# EAGLE design macrokeyboardV1.0 (EAGLE 9.6.2)
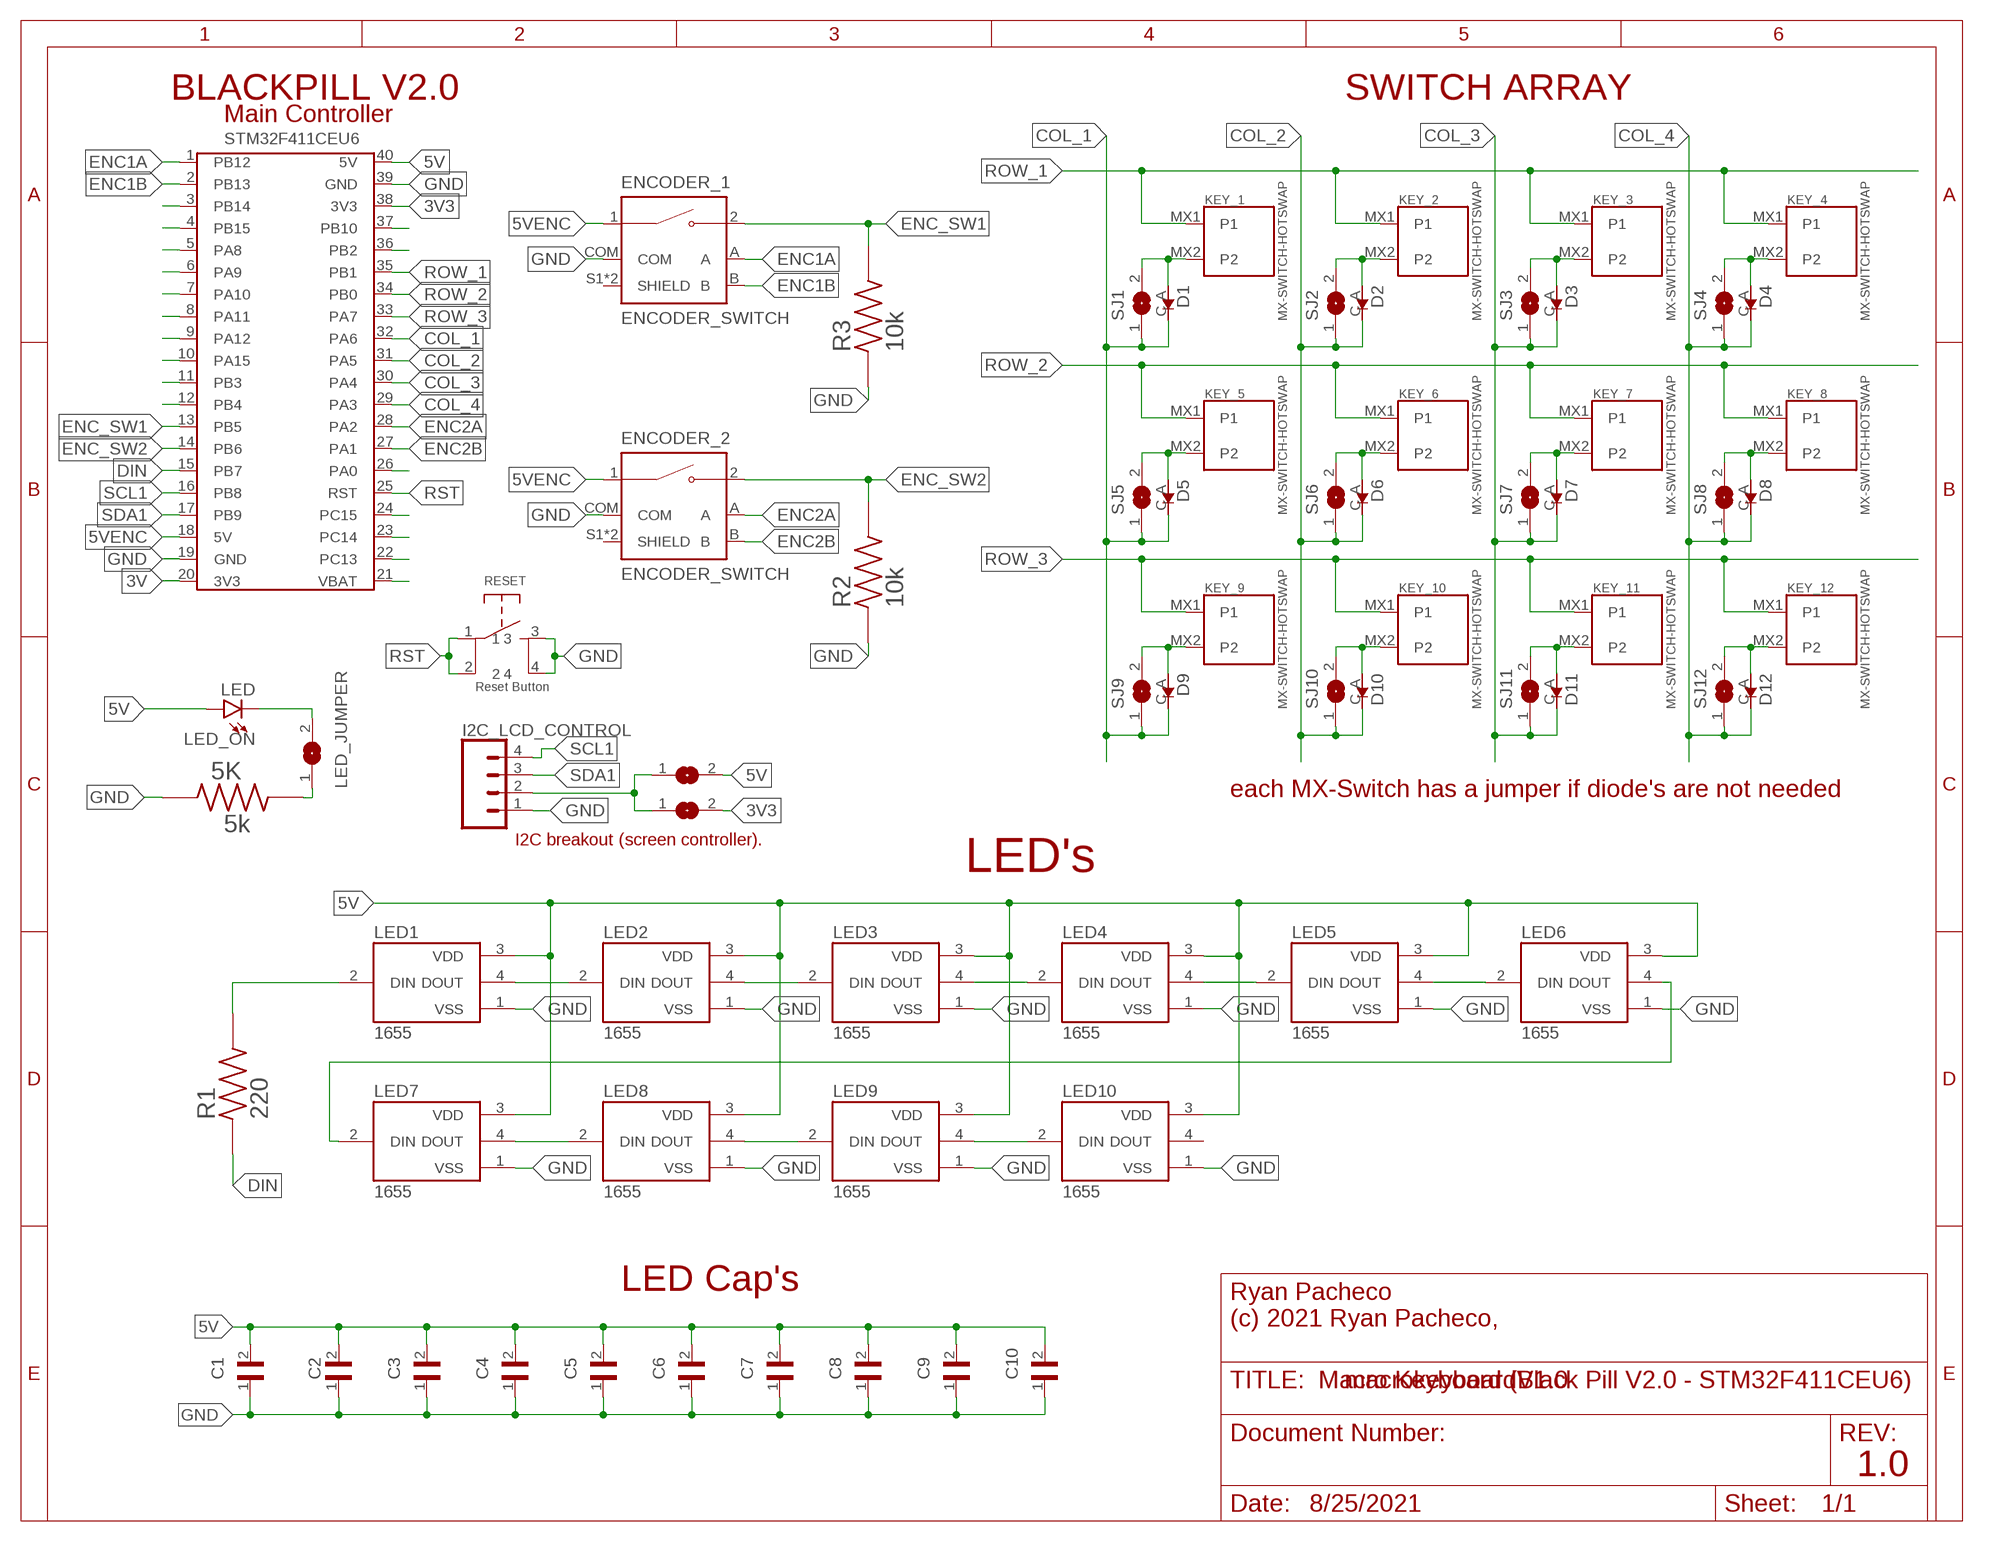
[diagram p0: schematic, sheet 1]

## Parts
3.3V_I2C  SJ  [SJ]
5K  5k  RMCF1206JT1K00  [RESC3216X70N]
5V_I2C  SJ  [SJ]
C1  100n  C1206C104K5RAC7210  [CAPC3216X88N]
C2  C1206C104K5RAC7210  [CAPC3216X88N]
C3  C1206C104K5RAC7210  [CAPC3216X88N]
C4  C1206C104K5RAC7210  [CAPC3216X88N]
C5  C1206C104K5RAC7210  [CAPC3216X88N]
C6  100nF  C1206C104K5RAC7210  [CAPC3216X88N]
C7  C1206C104K5RAC7210  [CAPC3216X88N]
C8  C1206C104K5RAC7210  [CAPC3216X88N]
C9  C1206C104K5RAC7210  [CAPC3216X88N]
C10  100nF  C1206C104K5RAC7210  [CAPC3216X88N]
D1  1N4148W-7-F  [SOD3715X135N]
D2  1N4148W-7-F  [SOD3715X135N]
D3  1N4148W-7-F  [SOD3715X135N]
D4  1N4148W-7-F  [SOD3715X135N]
D5  1N4148W-7-F  [SOD3715X135N]
D6  1N4148W-7-F  [SOD3715X135N]
D7  1N4148W-7-F  [SOD3715X135N]
D8  1N4148W-7-F  [SOD3715X135N]
D9  1N4148W-7-F  [SOD3715X135N]
D10  1N4148W-7-F  [SOD3715X135N]
D11  1N4148W-7-F  [SOD3715X135N]
D12  1N4148W-7-F  [SOD3715X135N]
ENCODER_1  ENCODER_SWITCH  PEC11R-4215F-S0024  [XDCR_PEC11R-4215F-S0024]
ENCODER_2  ENCODER_SWITCH  PEC11R-4215F-S0024  [XDCR_PEC11R-4215F-S0024]
I2C_LCD_CONTROL  CONN_04  [1X04]
KEY_1  MX-SWITCH-HOTSWAP  [MXHSPCB-1U]
KEY_2  MX-SWITCH-HOTSWAP  [MXHSPCB-1U]
KEY_3  MX-SWITCH-HOTSWAP  [MXHSPCB-1U]
KEY_4  MX-SWITCH-HOTSWAP  [MXHSPCB-1U]
KEY_5  MX-SWITCH-HOTSWAP  [MXHSPCB-1U]
KEY_6  MX-SWITCH-HOTSWAP  [MXHSPCB-1U]
KEY_7  MX-SWITCH-HOTSWAP  [MXHSPCB-1U]
KEY_8  MX-SWITCH-HOTSWAP  [MXHSPCB-1U]
KEY_9  MX-SWITCH-HOTSWAP  [MXHSPCB-1U]
KEY_10  MX-SWITCH-HOTSWAP  [MXHSPCB-1U]
KEY_11  MX-SWITCH-HOTSWAP  [MXHSPCB-1U]
KEY_12  MX-SWITCH-HOTSWAP  [MXHSPCB-1U]
LED1  1655  [LED_1655]
LED2  1655  [LED_1655]
LED3  1655  [LED_1655]
LED4  1655  [LED_1655]
LED5  1655  [LED_1655]
LED6  1655  [LED_1655]
LED7  1655  [LED_1655]
LED8  1655  [LED_1655]
LED9  1655  [LED_1655]
LED10  1655  [LED_1655]
LED_JUMPER  SJ  [SJ]
LED_ON  LED  LED1206  [LED-1206]
R1  220  RMCF1206JT1K00  [RESC3216X70N]
R2  10k  RMCF1206JT1K00  [RESC3216X70N]
R3  10k  RMCF1206JT1K00  [RESC3216X70N]
RESET  Reset Button  PUSHBUTTON(THROUGH_HOLE)  [PUSHBUTTON]
SJ1  SJ  [SJ]
SJ2  SJ  [SJ]
SJ3  SJ  [SJ]
SJ4  SJ  [SJ]
SJ5  SJ  [SJ]
SJ6  SJ  [SJ]
SJ7  SJ  [SJ]
SJ8  SJ  [SJ]
SJ9  SJ  [SJ]
SJ10  SJ  [SJ]
SJ11  SJ  [SJ]
SJ12  SJ  [SJ]
U$2  STM32F411CEU6  [BLACKPILL_V2]

## Nets
3V: U$2.20(3V3)
3V3: 3.3V_I2C.2 U$2.38(3V3)
5V: 5V_I2C.2 C1.2 C2.2 C3.2 C4.2 C5.2 C6.2 C7.2 C8.2 C9.2 C10.2 LED1.3(VDD) LED2.3(VDD) LED3.3(VDD) LED4.3(VDD) LED5.3(VDD) LED6.3(VDD) LED7.3(VDD) LED8.3(VDD) LED9.3(VDD) LED10.3(VDD) LED_ON.A U$2.40(5V)
5VENC: ENCODER_1.1 ENCODER_2.1 U$2.18(5V)
COL_1: D1.C(K) D5.C(K) D9.C(K) SJ1.1 SJ5.1 SJ9.1 U$2.32(PA6)
COL_2: D2.C(K) D6.C(K) D10.C(K) SJ2.1 SJ6.1 SJ10.1 U$2.31(PA5)
COL_3: D3.C(K) D7.C(K) D11.C(K) SJ3.1 SJ7.1 SJ11.1 U$2.30(PA4)
COL_4: D4.C(K) D8.C(K) D12.C(K) SJ4.1 SJ8.1 SJ12.1 U$2.29(PA3)
DIN: R1.1 U$2.15(PB7)
ENC1A: ENCODER_1.A U$2.1(PB12)
ENC1B: ENCODER_1.B U$2.2(PB13)
ENC2A: ENCODER_2.A U$2.28(PA2)
ENC2B: ENCODER_2.B U$2.27(PA1)
ENC_SW1: ENCODER_1.2 R3.2 U$2.13(PB5)
ENC_SW2: ENCODER_2.2 R2.2 U$2.14(PB6)
GND: 5K.2 C1.1 C2.1 C3.1 C4.1 C5.1 C6.1 C7.1 C8.1 C9.1 C10.1 ENCODER_1.COM ENCODER_2.COM I2C_LCD_CONTROL.1 LED1.1(VSS) LED2.1(VSS) LED3.1(VSS) LED4.1(VSS) LED5.1(VSS) LED6.1(VSS) LED7.1(VSS) LED8.1(VSS) LED9.1(VSS) LED10.1(VSS) R2.1 R3.1 RESET.3 RESET.4 U$2.19(GND) U$2.39(GND)
N$1: D1.A KEY_1.MX2(P2) SJ1.2
N$2: D2.A KEY_2.MX2(P2) SJ2.2
N$3: D3.A KEY_3.MX2(P2) SJ3.2
N$4: D4.A KEY_4.MX2(P2) SJ4.2
N$5: D5.A KEY_5.MX2(P2) SJ5.2
N$6: D6.A KEY_6.MX2(P2) SJ6.2
N$7: D7.A KEY_7.MX2(P2) SJ7.2
N$8: D8.A KEY_8.MX2(P2) SJ8.2
N$9: D9.A KEY_9.MX2(P2) SJ9.2
N$10: D10.A KEY_10.MX2(P2) SJ10.2
N$11: D11.A KEY_11.MX2(P2) SJ11.2
N$12: D12.A KEY_12.MX2(P2) SJ12.2
N$15: U$2.3(PB14)
N$16: U$2.4(PB15)
N$17: U$2.5(PA8)
N$18: U$2.6(PA9)
N$19: U$2.7(PA10)
N$20: U$2.8(PA11)
N$21: U$2.9(PA12)
N$22: U$2.10(PA15)
N$23: U$2.11(PB3)
N$24: U$2.12(PB4)
N$25: 5K.1 LED_JUMPER.1
N$27: LED_JUMPER.2 LED_ON.C
N$28: LED1.2(DIN) R1.2
N$29: LED1.4(DOUT) LED2.2(DIN)
N$30: LED2.4(DOUT) LED3.2(DIN)
N$31: LED7.4(DOUT) LED8.2(DIN)
N$32: LED8.4(DOUT) LED9.2(DIN)
N$33: U$2.23(PC14)
N$34: U$2.24(PC15)
N$35: 3.3V_I2C.1 5V_I2C.1 I2C_LCD_CONTROL.2
N$36: U$2.26(PA0)
N$37: LED6.4(DOUT) LED7.2(DIN)
N$39: LED9.4(DOUT) LED10.2(DIN)
N$42: LED5.4(DOUT) LED6.2(DIN)
N$43: U$2.21(VBAT)
N$44: LED4.4(DOUT) LED5.2(DIN)
N$45: LED3.4(DOUT) LED4.2(DIN)
N$47: U$2.36(PB2)
N$48: U$2.22(PC13)
N$49: U$2.37(PB10)
ROW_1: KEY_1.MX1(P1) KEY_2.MX1(P1) KEY_3.MX1(P1) KEY_4.MX1(P1) U$2.35(PB1)
ROW_2: KEY_5.MX1(P1) KEY_6.MX1(P1) KEY_7.MX1(P1) KEY_8.MX1(P1) U$2.34(PB0)
ROW_3: KEY_9.MX1(P1) KEY_10.MX1(P1) KEY_11.MX1(P1) KEY_12.MX1(P1) U$2.33(PA7)
RST: RESET.1 RESET.2 U$2.25(RST)
SCL1: I2C_LCD_CONTROL.4 U$2.16(PB8)
SDA1: I2C_LCD_CONTROL.3 U$2.17(PB9)
Unconnected: ENCODER_1.S1(SHIELD) ENCODER_1.S2(SHIELD) ENCODER_2.S1(SHIELD) ENCODER_2.S2(SHIELD) LED10.4(DOUT)

## Notes on the sheet
- BLACKPILL V2.0 | SWITCH ARRAY
- Main Controller
- each MX-Switch has a jumper if diode's are not needed
- I2C breakout (screen controller).
- LED's
- LED Cap's
- Ryan Pacheco
  (c) 2021 Ryan Pacheco,
- Macro Keyboard (Black Pill V2.0 - STM32F411CEU6)
- 1.0
- 8/25/2021

## Library data of the parts
3.3V_I2C 5V_I2C LED_JUMPER SJ1-SJ12 = jumper:SJ: SMD solder JUMPER
5K R1-R3 = RMCF1206JT1K00:RMCF1206JT1K00; DESCRIPTION: 1 kOhms ±5% 0.25W, 1/4W Chip Resistor 1206 (3216 Metric) Automotive AEC-Q200 Thick Film; DIGI-KEY_PART_NUMBER: RMCF1206JT1K00CT-ND; MF: Stackpole Electronics Inc; MP: RMCF1206JT1K00; PACKAGE: 3216 Stackpole
C1-C10 = C1206C104K5RAC7210:C1206C104K5RAC7210: Cap Ceramic 0.1uF 50V X7R 10% Pad SMD 1206 125°C T/R; DESCRIPTION: 0.1µF ±10% 50V Ceramic Capacitor X7R 1206 (3216 Metric); DIGI-KEY_PART_NUMBER: 399-7357-2-ND; MF: KEMET; MP: C1206C104K5RAC7210; PACKAGE: 3216 KEMET; PURCHASE-URL: https://pricing.snapeda.com/search/part/C1206C104K5RAC7210/?ref=eda
D1-D12 = 1N4148W-7-F:1N4148W-7-F: 1N4148W Series 2 A 100 V 400 mW Surface Mount Fast Switching Diode - SOD-123; DESCRIPTION: Diode Standard 100V 300mA (DC) Surface Mount SOD-123; DIGI-KEY_PART_NUMBER: 1N4148W-FDICT-ND; MF: Diodes Inc.; MP: 1N4148W-7-F; PACKAGE: SOD-123 Fairchild Semiconductor; PURCHASE-URL: https://pricing.snapeda.com/search/part/1N4148W-7-F/?ref=eda
ENCODER_1 ENCODER_2 = PEC11R-4215F-S0024:PEC11R-4215F-S0024: Incremental Encoder, 12 Mm, Contact Rating 10 Ma - 5 Vdc Check prices <https://pricing.snapeda.com/parts/PEC11R-4215F-S0024/Bourns/view-part?ref=eda>; AVAILABILITY: In Stock; DESCRIPTION: Rotary Encoder Mechanical 24 Quadrature (Incremental) Vertical; MF: Bourns; MP: PEC11R-4215F-S0024; PACKAGE: None; PRICE: None; PURCHASE-URL: https://pricing.snapeda.com/search/part/PEC11R-4215F-S0024/?ref=eda
I2C_LCD_CONTROL = SparkFun-Connectors:CONN_04: Multi connection point. Often used as Generic Header-pin footprint for 0.1 inch spaced/style header connections On any of the 0.1 inch spaced packages, you can populate with these: Break Away Headers - Straight <https://www.sparkfun.com/products/116> (PRT-00116) Break Away Male Headers - Right Angle <https://www.sparkfun.com/products/553> (PRT-00553) Female Headers <https://www.sparkfun.com/products/115> (PRT-00115) Break Away Headers - Machine Pin <https://www.sparkfun.com/products/117> (PRT-00117) Break Away Female Headers - Swiss Machine Pin <https://www.sparkfun.com/products/743> (PRT-00743) For SCREWTERMINALS and SPRING TERMINALS visit here: Screw Terimnals on SparkFun.com <https://www.sparkfun.com/search/results?term=Screw+Terminals> (5mm/3.5mm/2.54mm spacing) This device is also useful as a general connection point to wire up your design to another part of your project. Our various solder wires solder well into these plated through hole pads. Hook-Up Wire - Assortment (Stranded, 22 AWG) <https://www.sparkfun.com/products/11375> (PRT-11375) Hook-Up Wire - Assortment (Solid Core, 22 AWG) <https://www.sparkfun.com/products/11367> (PRT-11367) View the entire wire category on our website here <https://www.sparkfun.com/categories/141> Special notes: Molex polarized connector foot print use with SKU : PRT-08231 with associated crimp pins and housings. 1MM SMD Version SKU: PRT-10208; PROD_ID: CONN-09696
KEY_1-KEY_12 = Keyboard:MX-SWITCH-HOTSWAP: FOR KAILH HOTSWAPS WITH MX_SWITCHES
LED1-LED10 = 1655:1655: Ws2812b 5050 Rgb Led With Integrated Driver Chip Pack Of 10; DESCRIPTION: Addressable Lighting Neopixel 10 LED Discrete Serial (Shift Register) Red, Green, Blue (RGB) 5.00mm L x 5.00mm W; MF: Adafruit; MP: 1655; PACKAGE: TO-3 Adafruit; PURCHASE-URL: https://pricing.snapeda.com/search/part/1655/?ref=eda
LED_ON = SparkFun-LED:LED: LED (Generic) Standard schematic elements and footprints for 5mm, 3mm, 1206, and 0603 sized LEDs. Generic LEDs with no color specified.
RESET = pushbutton (through hole):PUSHBUTTON(THROUGH_HOLE)
U$2 = BlackPill_STM32F411CEU6:STM32F411CEU6

## Board
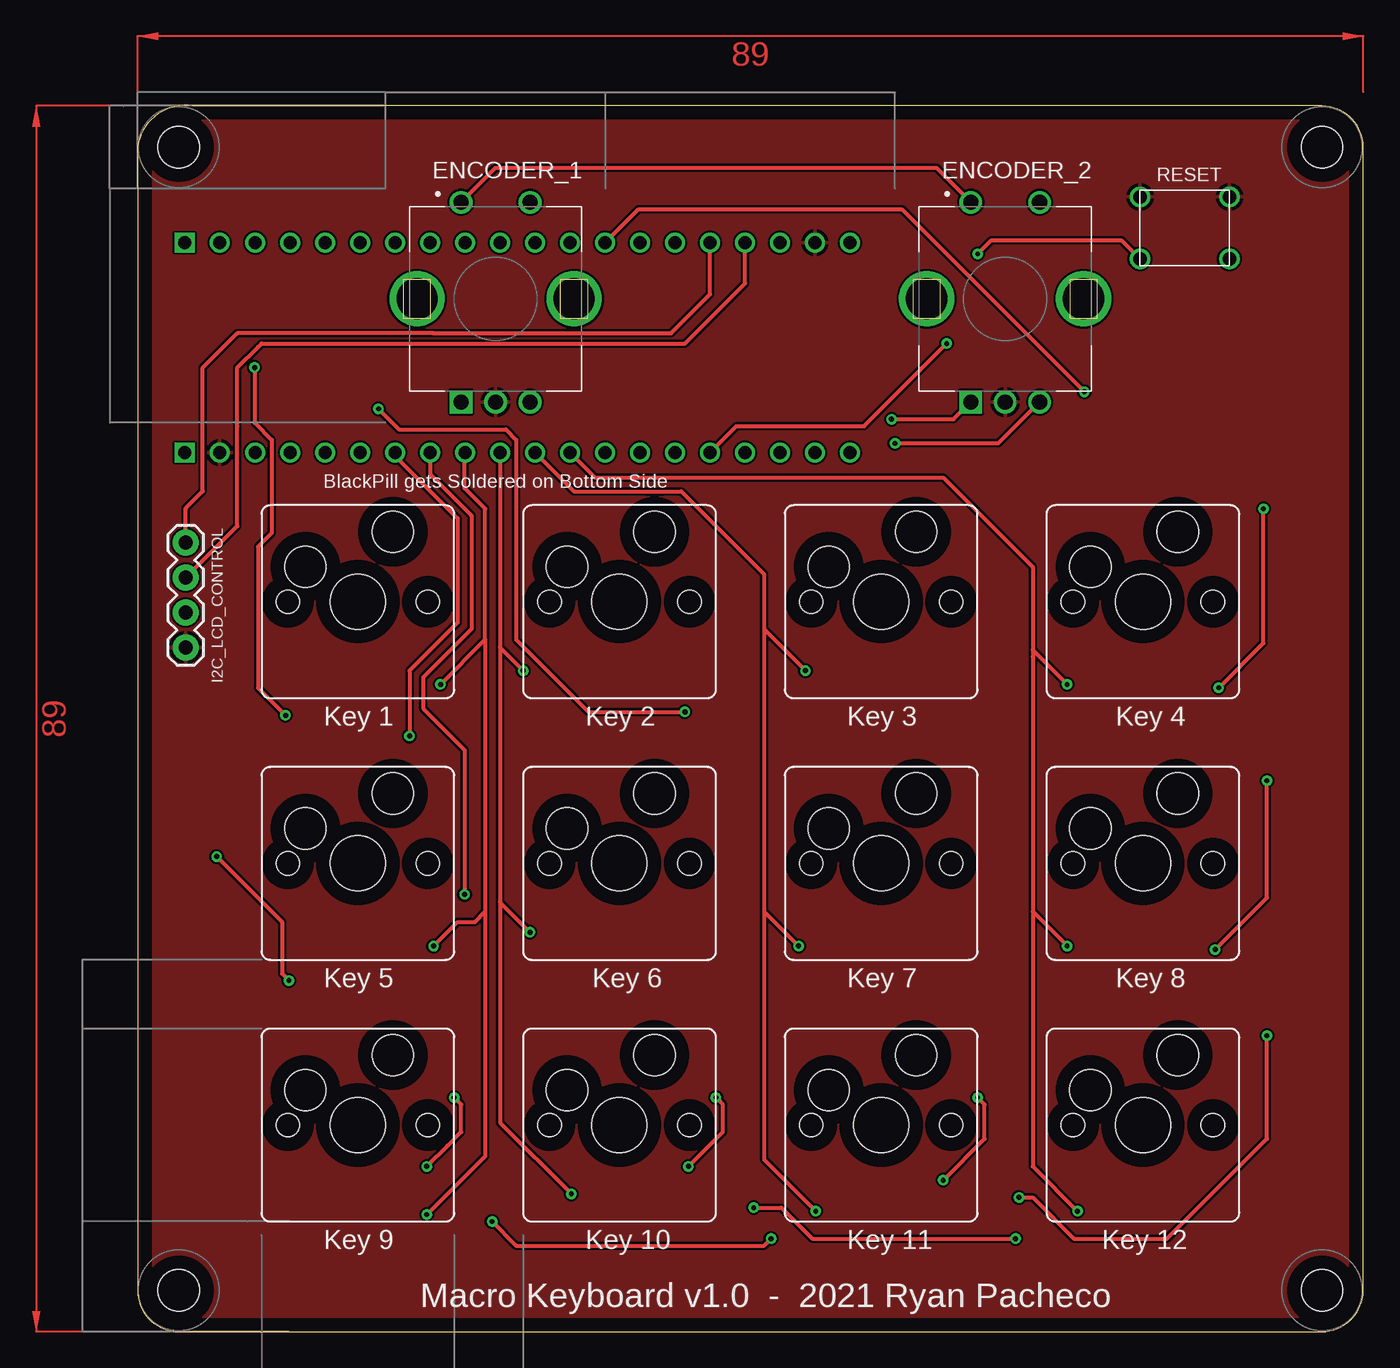
[diagram p1: board, top side]
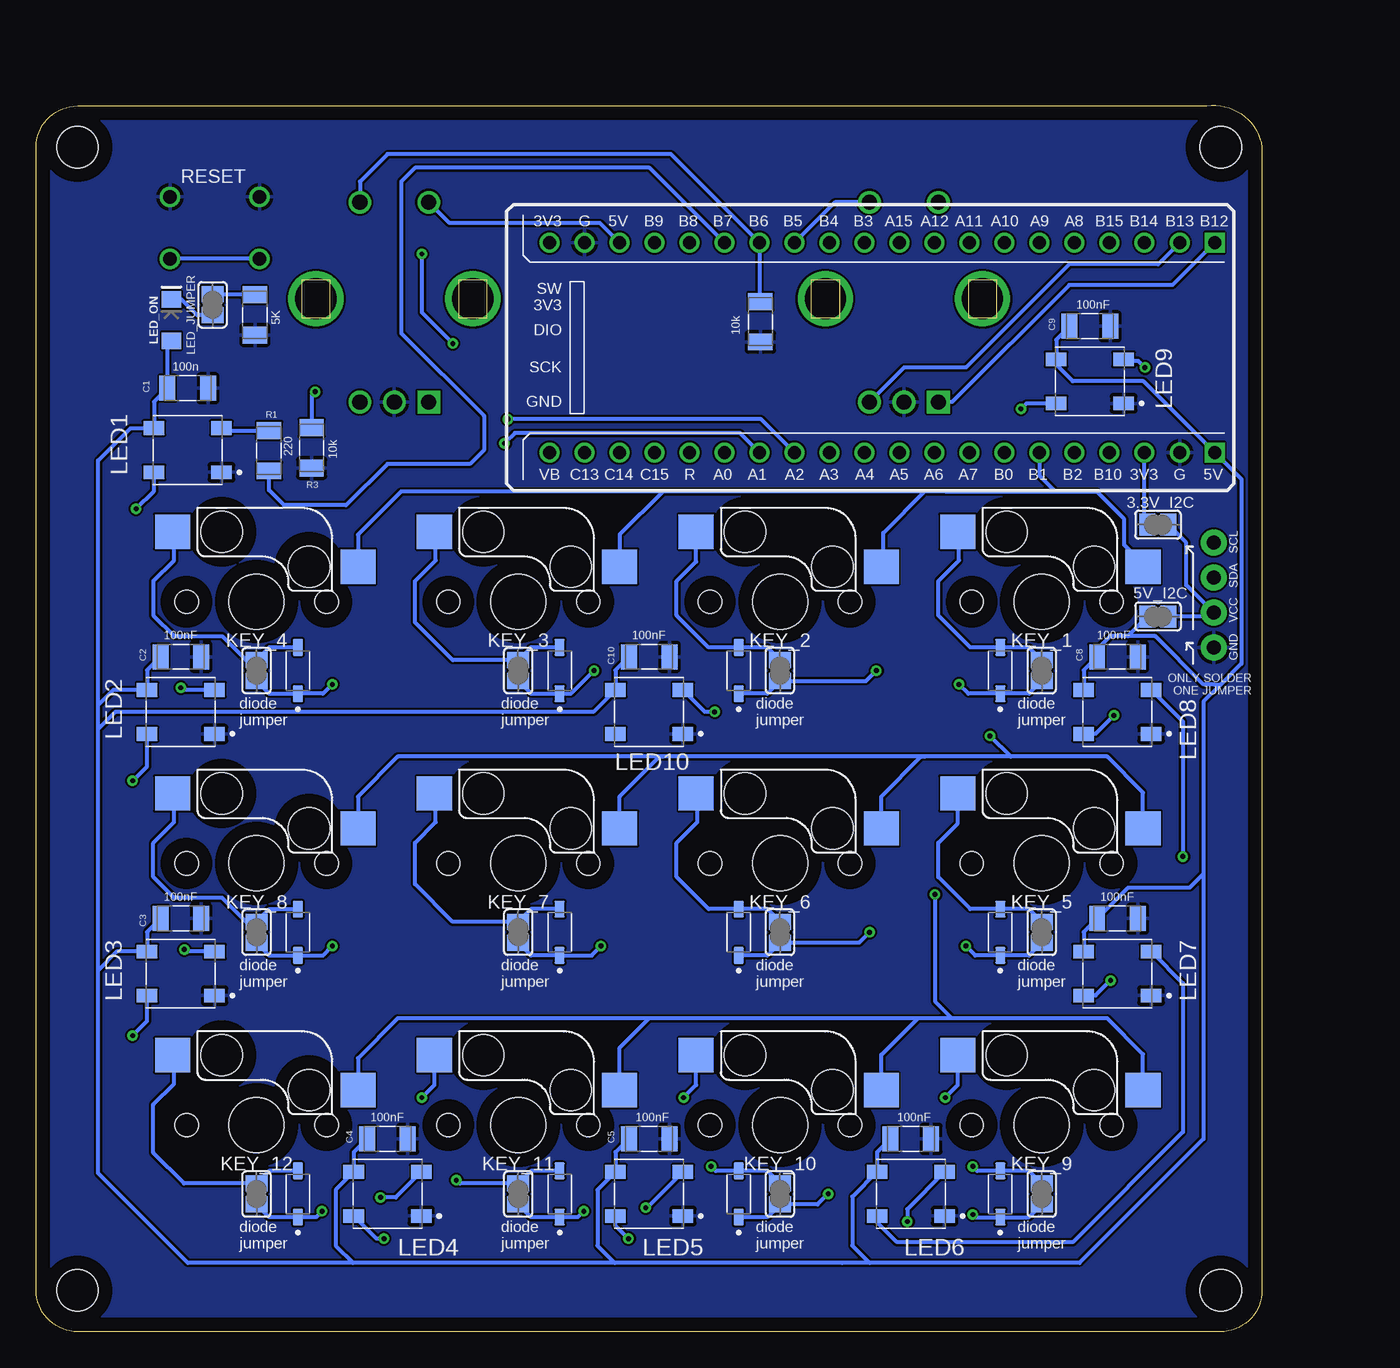
[diagram p2: board, bottom side, seen from below]

Size 89 x 89.03 mm. Coordinates in mm from the lower left corner, seen from the top.
Outline: 0,86 0,3 arc90 3,0 86,0 arc90 89,3 89,86 arc90 86,89 4,89 arc90 0,86
Copper layers (1*16): Top 0.035mm / dielectric 1.5mm / Bottom 0.035mm
Design rules "default": minimum track width 6mil, minimum drill 0.35mm, track to track 6mil, track to pad 6mil, pad to pad 6mil, via to via 6mil, smd to smd 6mil, copper to edge 40mil, drill to drill 6mil, minimum pad ring 10mil, minimum via ring 8mil, stop-mask expansion 4mil, vias tented up to drill 0mil, thermal gap 10mil
Holes 3 mm at 3,86 86,86 3,3 86,3

### Footprints (pad centres in the part's own frame; a part is rotated, then mirrored left to right if it is on the bottom)
SJ = smd 1.168 x 1.6: 1 -0.762,0; 2 0.762,0
RESC3216X70N = smd 1.23 x 1.77: 1 -1.466,0; 2 1.466,0
CAPC3216X88N = smd 1.16 x 1.82: 1 -1.475,0; 2 1.475,0
SOD3715X135N = smd 1.21 x 0.73: A 1.68,0; C -1.68,0
XDCR_PEC11R-4215F-S0024 = drill 1.1: 1 -2.5,7; 2 2.5,7; B 2.5,-7.5; COM 0,-7.5 | drill 1.1 square: A -2.5,-7.5 | drill 3: S1 -5.7,0; S2 5.7,0
1X04 = drill 1.016 pad 1.88: 1 0,0; 2 2.54,0; 3 5.08,0; 4 7.62,0
MXHSPCB-1U = smd 2.55 x 2.5: MX1 7.36,2.54; MX2 -6.09,5.08 | hole 4: 0,0 | hole 1.7: 5.08,0; -5.08,0 | hole 3: 3.81,2.54; -2.54,5.08
LED_1655 = smd 1.5 x 1: 1 -2.45,1.6; 2 -2.45,-1.6; 3 2.45,-1.6; 4 2.45,1.6
LED-1206 = smd 1.2 x 1.4: A -1.5,0; C 1.5,0
PUSHBUTTON = drill 1: 1 -3.5,2.5; 2 3,2.5; 3 -3.5,-2; 4 3,-2
BLACKPILL_V2 = drill 0.92 square: 1 -25.005,-7.62; 40 -25.005,7.62 | drill 0.92: 2 -22.465,-7.62; 3 -19.89,-7.62; 4 -17.35,-7.62; 5 -14.81,-7.62; 6 -12.27,-7.62; 7 -9.73,-7.62; 8 -7.19,-7.62; 9 -4.65,-7.62; 10 -2.11,-7.62; 11 0.43,-7.62; 12 2.97,-7.62; 13 5.51,-7.62; 14 8.05,-7.62; 15 10.59,-7.62; 16 13.13,-7.62; 17 15.67,-7.62; 18 18.21,-7.62; 19 20.75,-7.62; 20 23.29,-7.62; 21 23.29,7.62; 22 20.75,7.62; 23 18.21,7.62; 24 15.67,7.62; 25 13.13,7.62; 26 10.59,7.62; 27 8.05,7.62; 28 5.51,7.62; 29 2.97,7.62; 30 0.43,7.62; 31 -2.11,7.62; 32 -4.65,7.62; 33 -7.19,7.62; 34 -9.73,7.62; 35 -12.27,7.62; 36 -14.81,7.62; 37 -17.35,7.62; 38 -19.89,7.62; 39 -22.465,7.62

### Placement (x,y rotation side)
3.3V_I2C  7.56,58.59 180 bottom
5K  73.12,73.83 270 bottom
5V_I2C  7.56,51.92 180 bottom
C1  78,68.5 180 bottom
C2  78.5,49 180 bottom
C3  78.5,30 180 bottom
C4  63.5,14 180 bottom
C5  44.5,14 180 bottom
C6  25.5,14 180 bottom
C7  10.5,30 180 bottom
C8  10.5,49 180 bottom
C9  12.5,73 180 bottom
C10  44.5,49 180 bottom
D1  19,48 90 bottom
D2  38,48 90 bottom
D3  51,48 90 bottom
D4  70,48 90 bottom
D5  19,29 90 bottom
D6  38,29 90 bottom
D7  51,29 90 bottom
D8  70,29 90 bottom
D9  19,10 90 bottom
D10  38,10 90 bottom
D11  51,10 90 bottom
D12  70,10 90 bottom
ENCODER_1  26,75 0 top
ENCODER_2  63,75 0 top
I2C_LCD_CONTROL  3.51,49.67 90 top
KEY_1  16,53 0 bottom
KEY_2  35,53 0 bottom
KEY_3  54,53 0 bottom
KEY_4  73,53 0 bottom
KEY_5  16,34 0 bottom
KEY_6  35,34 0 bottom
KEY_7  54,34 0 bottom
KEY_8  73,34 0 bottom
KEY_9  16,15 0 bottom
KEY_10  35,15 0 bottom
KEY_11  54,15 0 bottom
KEY_12  73,15 0 bottom
LED1  78,64 180 bottom
LED2  78.5,45 180 bottom
LED3  78.5,26 180 bottom
LED4  63.5,10 180 bottom
LED5  44.5,10 180 bottom
LED6  25.5,10 180 bottom
LED7  10.5,26 180 bottom
LED8  10.5,45 180 bottom
LED9  12.5,69 180 bottom
LED10  44.5,45 180 bottom
LED_JUMPER  76.2,74.56 270 bottom
LED_ON  79.19,73.44 90 bottom
R1  72.1,63.97 90 bottom
R2  36.42,73.33 90 bottom
R3  69,64.17 90 bottom
RESET  75.79,80.39 180 top
SJ1  16,48 90 bottom
SJ2  35,48 90 bottom
SJ3  54,48 90 bottom
SJ4  73,48 90 bottom
SJ5  16,29 90 bottom
SJ6  35,29 90 bottom
SJ7  54,29 90 bottom
SJ8  73,29 90 bottom
SJ9  16,10 90 bottom
SJ10  35,10 90 bottom
SJ11  54,10 90 bottom
SJ12  73,10 90 bottom
U$2  28.44,71.45 180 bottom

### Tracks (layer width: path | path; a pad name or v marks a point on that pad's centre or on a via)
3V3
  Bottom 0.305: 3.3V_I2C.2 8.55,58.82 U$2.38
5V
  Bottom 0.305: C1.2 79.49,68.49 | 79.49,68.49 80.45,67.53 LED1.3 82.15,65.6 84.5,63.25 84.5,45.5 | C6.2 27.95,13.03 LED6.3 29.75,9.8 29.75,6.25 28.5,5 | C5.2 46.95,13.03 LED5.3 48.25,10.3 48.25,6.25 47,5 | C4.2 65.95,13.03 LED4.3 67.25,10.3 67.25,6.25 66,5 | LED7.3 12.95,29.02 C7.2 9.72,32.25 5.25,32.25 4.25,33.25 | C8.2 11.99,48.99 | 11.99,48.99 12.95,48.02 LED8.3 | 5V_I2C.2 9.74,50.5 | 11.99,48.99 11.99,49.51 11,50.5 9.99,50.5 9.74,50.5 | C10.2 46.95,48.02 LED10.3 48.55,45 83.25,45 84.5,43.75 | C3.2 80.95,29.02 LED3.3 83.15,27.6 84.5,26.25 | C2.2 80.95,48.02 LED2.3 83.4,46.6 84.5,45.5 | C9.2 14.95,72.03 LED9.3 14.95,70.2 13.75,69 8.61,69 U$2.40 1.5,61.9 1.5,48.5 3,47 | 9.74,50.5 7.75,50.5 4.25,47 3.5,47 3,47 | 3,47 4.25,45.75 4.25,33.25 | 4.25,33.25 4.25,14 13.25,5 28.5,5 | 84.5,26.25 84.5,11.5 78,5 66,5 | 84.5,26.25 84.5,43.75 | 84.5,43.75 84.5,45.5 | 28.5,5 30.5,5 47,5 | 47,5 66,5 | LED_ON.A 79.49,71.64 79.49,68.49
5VENC
  Top 0.305: ENCODER_1.1 26,84.5 58,84.5 ENCODER_2.1
  Bottom 0.305: U$2.18 48.08,80.5 59,80.5 ENCODER_2.1
COL_1  (via drill 0.35)
  Top 0.305: v21,8.5 25.25,12.75 25.25,30.5 | 25.25,50.25 25.25,59.75 23.75,61.25 23.75,63.79 U$2.32 | 25.25,50.25 25.25,31.75 25.25,30.5 | v22,47 25.25,50.25 | v21.5,28 23.25,29.75 24.5,29.75 25.25,30.5
  Bottom 0.305: SJ9.1 16.92,8.32 D9.C 20.82,8.32 v21,8.5 | SJ5.1 16.92,27.32 D5.C 20.82,27.32 v21.5,28 | SJ1.1 16.92,46.32 D1.C 21.32,46.32 v22,47
COL_2  (via drill 0.35)
  Top 0.305: 26.33,49.75 26.33,31.25 | 26.33,31.25 26.33,15.17 v31.5,10 | v28.5,29 26.33,31.17 26.33,31.25 | v28,48 26.33,49.67 26.33,49.75 | U$2.31 26.33,49.75
  Bottom 0.305: D10.C 35.92,8.32 SJ10.1 32.26,9.24 v31.5,10 | D6.C 35.92,27.32 SJ6.1 29.26,28.24 v28.5,29 | D2.C 35.92,46.32 SJ2.1 28.76,47.24 v28,48
COL_3  (via drill 0.35)
  Top 0.305: v49.25,8.75 45.5,12.5 45.5,30.5 | 45.5,51 45.5,55 39.5,61 31.7,61 U$2.30 | 45.5,51 45.5,30.5 | v48,28 45.5,30.5 | v48.5,48 45.5,51
  Bottom 0.305: SJ11.1 53.08,8.32 D11.C 49.68,8.32 v49.25,8.75 | SJ7.1 53.08,27.32 D7.C 48.68,27.32 v48,28 | SJ3.1 53.08,46.32 D3.C 50.18,46.32 v48.5,48
COL_4  (via drill 0.35)
  Top 0.305: v68.25,8.75 65,12 65,30.5 | 65,49.5 65,55.5 58.5,62 33.24,62 U$2.29 | 65,49.5 65,49 65,30.5 | v67.5,28 65,30.5 | 65,49.5 v67.5,47
  Bottom 0.305: SJ12.1 72.08,8.32 D12.C 68.68,8.32 v68.25,8.75 | SJ8.1 72.08,27.32 D8.C 68.18,27.32 v67.5,28 | SJ4.1 72.08,46.32 D4.C 68.18,46.32 v67.5,47
DIN
  Bottom 0.305: R1.1 72.1,61.1 71,60 66.5,60 63.5,63 57.5,63 56.5,64 56.5,66.5 62.5,72.5 62.5,83.5 61.5,84.5 44.46,84.5 U$2.15
ENC1A
  Bottom 0.305: U$2.1 6.5,76 14,76 22.5,67.5 ENCODER_1.A
ENC1B
  Bottom 0.305: U$2.2 7.54,77.5 14,77.5 21.5,70 26,70 ENCODER_1.B
ENC2A  (via drill 0.35)
  Top 0.305: v54.75,66.25 59.25,66.25 ENCODER_2.A
  Bottom 0.305: U$2.28 36.37,66.25 v54.75,66.25
ENC2B  (via drill 0.35)
  Top 0.305: v55,64.5 62.5,64.5 ENCODER_2.B
  Bottom 0.305: U$2.27 37.91,65.25 38.5,65.25 54.25,65.25 v55,64.5
ENC_SW1  (via drill 0.35)
  Top 0.305: U$2.13 36.38,81.5 55.5,81.5 v68.75,68.25
  Bottom 0.305: ENCODER_1.2 31.02,82 U$2.13 | v68.75,68.25 69,68 R3.2
ENC_SW2
  Bottom 0.305: R2.2 36.49,74.87 U$2.14 42.92,85.5 63.5,85.5 65.5,83.5 ENCODER_2.2
GND
  pour Top: 86,0 3,0 arc-90 0,3 0,86 arc-90 3,89 86,89 arc-90 89,86 89,3 arc-90
  pour Bottom: 86,0 3,0 arc-90 0,3 0,85.5 arc-90 3.5,89 86,89 arc-90 89,86 89,3 arc-90
N$1
  Bottom 0.305: SJ1.2 16.92,49.68 D1.A 21.18,49.68 23.5,52 23.5,54.5 22,56 22,57.99 KEY_1.MX2
N$2
  Bottom 0.305: SJ2.2 35.92,49.68 D2.A 40.18,49.68 42.5,52 42.5,54.5 41.09,55.91 KEY_2.MX2
N$3
  Bottom 0.305: D3.A 53.08,49.68 SJ3.2 58.76,48.76 61.5,51.5 61.5,54.5 60,56 60,57.99 KEY_3.MX2
N$4
  Bottom 0.305: D4.A 72.08,49.68 SJ4.2 73.76,48.76 75.5,50.5 79,50.5 80.5,52 80.5,54.5 79,56 79,57.99 KEY_4.MX2
N$5
  Bottom 0.305: SJ5.2 16.92,30.68 D5.A 21.18,30.68 23.5,33 23.5,35.5 22.09,36.91 KEY_5.MX2
N$6
  Bottom 0.305: SJ6.2 35.92,30.68 D6.A 40.18,30.68 42.5,33 42.5,35.5 41,37 41,38.99 KEY_6.MX2
N$7
  Bottom 0.305: D7.A 53.08,30.68 SJ7.2 58.76,29.76 61.5,32.5 61.5,35.5 60,37 60,38.99 KEY_7.MX2
N$8
  Bottom 0.305: D8.A 72.08,30.68 SJ8.2 73.76,29.76 75.5,31.5 79,31.5 80.5,33 80.5,35.5 79,37 79,38.99 KEY_8.MX2
N$9  (via drill 0.35)
  Top 0.305: v21,12 22.5,13.5 23.5,14.5 23.5,16.5 v23,17
  Bottom 0.305: SJ9.2 16.92,11.68 D9.A 20.68,11.68 v21,12 | v23,17 22.09,17.91 KEY_9.MX2
N$10  (via drill 0.35)
  Top 0.305: v40,12 42.5,14.5 42.5,16.5 v42,17
  Bottom 0.305: SJ10.2 35.92,11.68 D10.A 39.68,11.68 v40,12 | v42,17 41.09,17.91 KEY_10.MX2
N$11  (via drill 0.35)
  Top 0.305: v58.5,11 61.5,14 61.5,16.5 v61,17
  Bottom 0.305: D11.A 53.08,11.68 SJ11.2 58.26,10.76 v58.5,11 | v61,17 60.09,17.91 KEY_11.MX2
N$12
  Bottom 0.305: D12.A 72.08,11.68 SJ12.2 78.26,10.76 80.5,13 80.5,16.5 79,18 79,19.99 KEY_12.MX2
N$25
  Bottom 0.305: 5K.1 76.17,75.3 LED_JUMPER.1
N$27
  Bottom 0.305: LED_JUMPER.2 77.3,73.8 78.44,74.94 LED_ON.C
N$28
  Bottom 0.305: LED1.2 75.39,65.44 R1.2
N$29  (via drill 0.35)
  Top 0.305: v78.5,46.75 81.75,50 v81.75,59.75
  Bottom 0.305: LED2.2 78.35,46.6 v78.5,46.75 | v81.75,59.75 80.45,61.05 LED1.4
N$30  (via drill 0.35)
  Top 0.305: v78.25,27.75 82,31.5 v82,40
  Bottom 0.305: LED3.2 78.1,27.6 v78.25,27.75 | v82,40 80.95,41.05 LED2.4
N$31  (via drill 0.35)
  Top 0.305: v5.75,34.5 10.5,29.75 10.5,26 v11,25.5
  Bottom 0.305: LED8.2 5.75,44.3 v5.75,34.5 | v11,25.5 12.1,24.4 LED7.4
N$32  (via drill 0.35)
  Top 0.305: v8.5,70 8.5,66 9.75,64.75 9.75,58 8.75,57 8.75,46.75 v10.75,44.75
  Bottom 0.305: LED9.2 9.95,70.5 9,70.5 v8.5,70 | v10.75,44.75 12.1,43.4 LED8.4
N$35
  Bottom 0.305: 5V_I2C.1 3.8,51.92 I2C_LCD_CONTROL.2 5.5,54.2 5.5,57.29 3.3V_I2C.1
N$37
  Bottom 0.305: LED7.2 5.75,25.3 5.75,14.5 13.75,6.5 26.5,6.5 27.95,7.95 LED6.4
N$39  (via drill 0.35)
  Top 0.305: v17.5,67 19,65.5 26.75,65.5 27.5,64.75 27.5,50.25 32.75,45 v39.75,45
  Bottom 0.305: LED9.4 17.1,67.4 v17.5,67 | v39.75,45 40.45,45 LED10.2
N$42  (via drill 0.35)
  Top 0.305: v25.75,8 27.5,6.25 45.5,6.25 v46,6.75
  Bottom 0.305: LED6.2 25.75,8.9 v25.75,8 | v46,6.75 46.95,7.7 LED5.4
N$44  (via drill 0.35)
  Top 0.305: v44.75,9 46.75,9 49,6.75 v63.75,6.75
  Bottom 0.305: LED5.2 44.65,9 v44.75,9 | v63.75,6.75 64.3,6.75 LED4.4
N$45  (via drill 0.35)
  Top 0.305: v64,9.75 65,9.75 68,6.75 74.75,6.75 82,14 v82,21.5
  Bottom 0.305: LED4.2 62.9,9.75 v64,9.75 | v82,21.5 80.95,22.55 LED3.4
ROW_1
  Bottom 0.305: KEY_1.MX1 9.52,56.42 9.52,56.65 10,57.12 10,59 12,61 15,61 | 15,61 23,61 24.5,61 | 24.5,61 43.5,61 | KEY_3.MX1 46.64,57.86 43.5,61 | KEY_2.MX1 27.5,55.68 27.5,58 24.5,61 | 43.5,61 62.5,61 65.64,57.86 KEY_4.MX1 | U$2.35 16.17,62.17 15,61
ROW_2  (via drill 0.35)
  Top 0.305: U$2.34 18.71,63.58 23.25,59.04 23.25,51.5 19.75,48 v19.75,43.25
  Bottom 0.305: KEY_5.MX1 8.64,39.14 11.25,41.75 18.25,41.75 | KEY_8.MX1 65.64,38.86 62.75,41.75 43.5,41.75 | 18.25,41.75 24.5,41.75 | 24.5,41.75 43.5,41.75 | KEY_7.MX1 46.64,38.86 43.75,41.75 43.5,41.75 | KEY_6.MX1 27.64,38.86 24.75,41.75 24.5,41.75 | v19.75,43.25 18.25,41.75
ROW_3  (via drill 0.35)
  Top 0.305: U$2.33 21.25,62.25 24.25,59.25 24.25,51 20.75,47.5 20.75,45.25 23.75,42.25 v23.75,31.75
  Bottom 0.305: KEY_9.MX1 8.64,20.14 11.25,22.75 22.5,22.75 | KEY_12.MX1 65.64,19.86 62.75,22.75 44.5,22.75 | 22.5,22.75 25,22.75 | 25,22.75 44.5,22.75 | KEY_11.MX1 46.64,20.61 44.5,22.75 | KEY_10.MX1 27.64,20.11 25,22.75 | v23.75,31.75 23.75,24 22.5,22.75
RST  (via drill 0.35)
  Top 0.305: U$2.25 43.49,65.75 52.75,65.75 v58.75,71.75 | v61,78.25 62,79.25 71.43,79.25 RESET.2
  Bottom 0.305: RESET.2 RESET.1 | v58.75,71.75 61,74 v61,78.25
SCL1
  Top 0.305: I2C_LCD_CONTROL.4 3.51,59.79 4.75,61.03 4.75,70 7.25,72.5 21.5,72.5 38.75,72.5 41.57,75.32 U$2.16
SDA1
  Top 0.305: I2C_LCD_CONTROL.3 7.25,58.49 7.25,65.75 7.25,70 8.75,71.5 9,71.75 39.75,71.75 44.11,76.11 U$2.17
(copper drawn outside any net)
  shapes: Top area x2

### Text on the board
tPlace: RESET | BlackPill gets Soldered on Bottom Side | Key 1 | Key 2 | Key 3 | Key 4 | Key 5 | Key 6 | Key 7 | Key 8 | Key 9 | Key 10 | Key 11 | Key 12 | Macro Keyboard v1.0 - 2021 Ryan Pacheco
bPlace: 100nF | 10k | 220 | SCL | SDA | VCC | 100nF | 100nF | 100nF | GND | ONLY SOLDER / ONE JUMPER | diode / jumper | diode / jumper | diode / jumper | diode / jumper | 100nF | 100nF | diode / jumper | diode / jumper | diode / jumper | diode / jumper | 100nF | 100nF | 100nF | diode / jumper | diode / jumper | diode / jumper | diode / jumper
bNames: 10k